# EAGLE design true_bypass_switch (EAGLE 5.10)
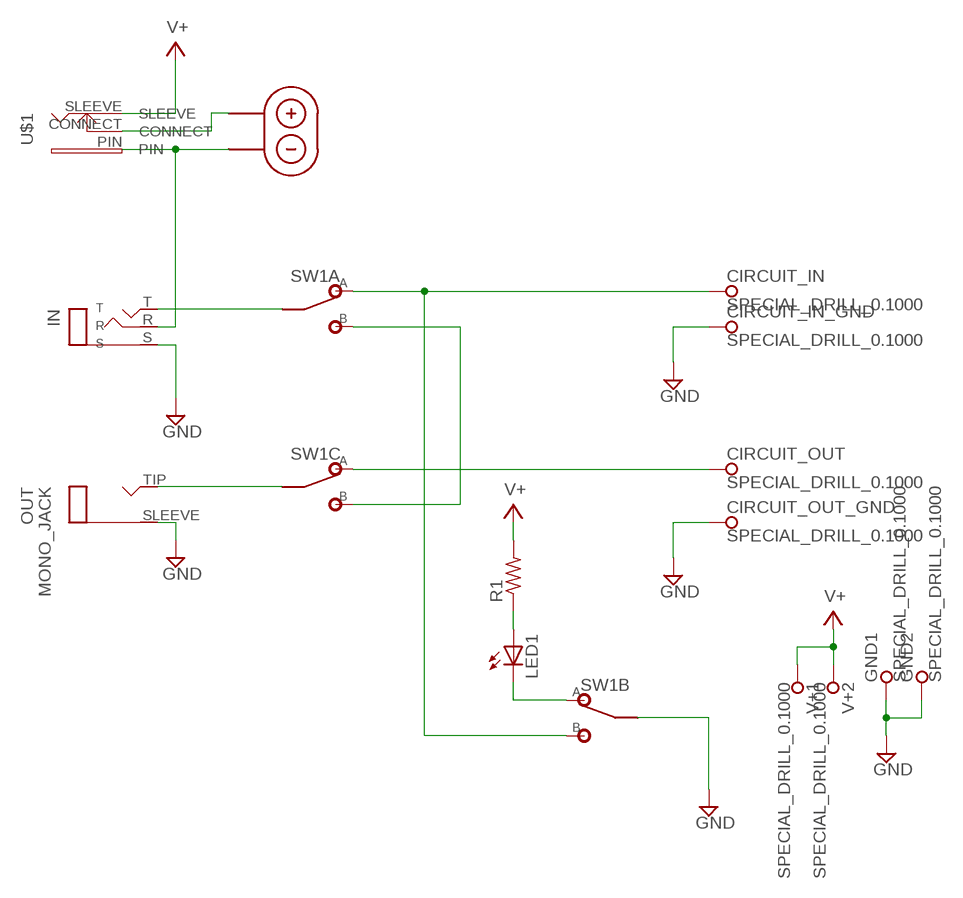
[diagram p0: schematic, sheet 1]

## Parts
CIRCUIT_IN  SPECIAL_DRILL_0.1000  [PAD_0.1000]
CIRCUIT_IN_GND  SPECIAL_DRILL_0.1000  [PAD_0.1000]
CIRCUIT_OUT  SPECIAL_DRILL_0.1000  [PAD_0.1000]
CIRCUIT_OUT_GND  SPECIAL_DRILL_0.1000  [PAD_0.1000]
GND1  SPECIAL_DRILL_0.1000  [PAD_0.1000]
GND2  SPECIAL_DRILL_0.1000  [PAD_0.1000]
IN  STEREO_JACK  [STEREO_JACK]
LED1  LED5MM  [LED5MM]
OUT  MONO_JACK  [MONO_JACK]
R1  RESISTOR  [RESISTOR]
SW1  3PDT  [3PDT]
U$1  DC_JACK_OFFBOARD  [DC_JACK_OFFBOARD]
U$2  9V_BATTERY_CLIP  [9V_BATTERY]
V+1  SPECIAL_DRILL_0.1000  [PAD_0.1000]
V+2  SPECIAL_DRILL_0.1000  [PAD_0.1000]

## Nets
CIRCUIT_IN: CIRCUIT_IN.1 SW1.A1(A:A) SW1.B3(B:B)
CIRCUIT_OUT: CIRCUIT_OUT.1 SW1.C1(C:A)
GND: CIRCUIT_IN_GND.1 CIRCUIT_OUT_GND.1 GND1.1 GND2.1 IN.S OUT.SLEEVE SW1.B2(B:COM)
N$2: U$1.CONNECT U$2.9V_BATTERY_+
N$3: IN.T SW1.A2(A:COM)
N$4: OUT.TIP SW1.C2(C:COM)
N$5: SW1.A3(A:B) SW1.C3(C:B)
N$6: LED1.K(C) SW1.B1(B:A)
N$7: LED1.A R1.1
N$8: IN.R U$1.PIN U$2.9V_BATTERY_-
V+: R1.2 U$1.SLEEVE V+1.1 V+2.1

## Library data of the parts
CIRCUIT_IN CIRCUIT_IN_GND CIRCUIT_OUT CIRCUIT_OUT_GND GND1 GND2 V+1 V+2 = special-drill:SPECIAL_DRILL_: Special drills
IN = 00_steve:STEREO_JACK
LED1 = SparkFun:LED: LEDs Standard schematic elements and footprints for 5mm, 3mm, 1206, and 0603 sized LEDs. 5mm - Spark Fun Electronics SKU : COM-00529 (and others)
OUT = 00_steve:MONO_JACK
R1 = 00_steve:RESISTOR
SW1 = 00_steve:3PDT
U$1 = 00_steve:DC_JACK_OFFBOARD
U$2 = 00_steve:9V_BATTERY_CLIP

## Board
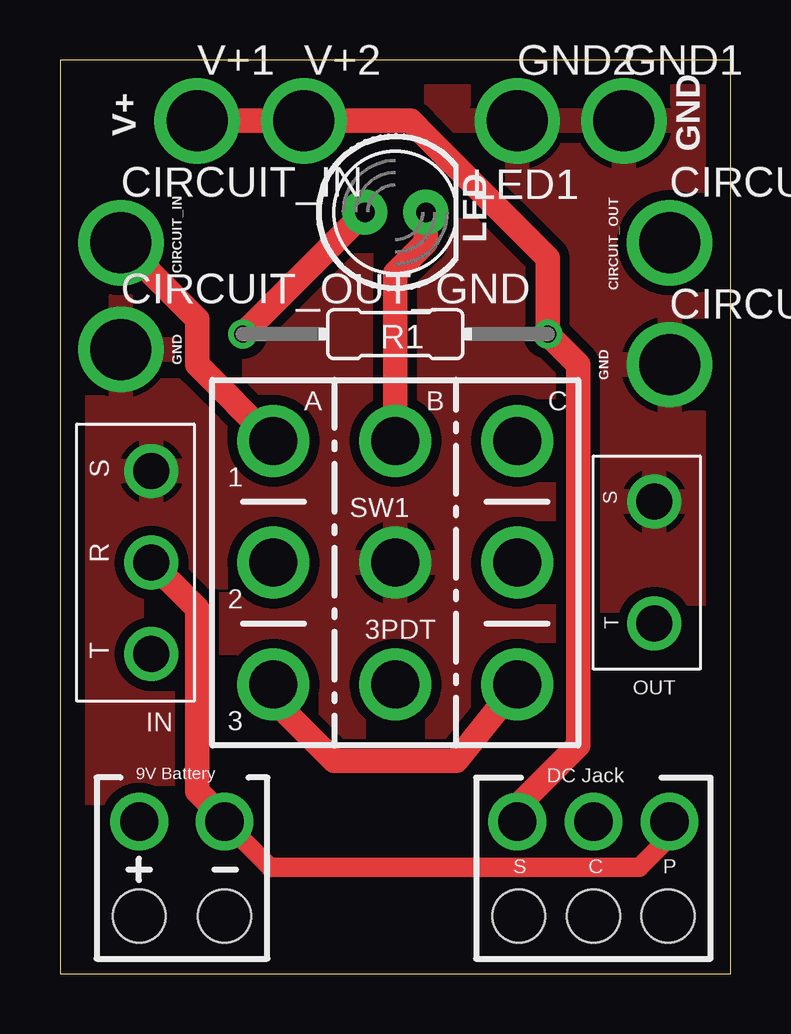
[diagram p1: board, top side]
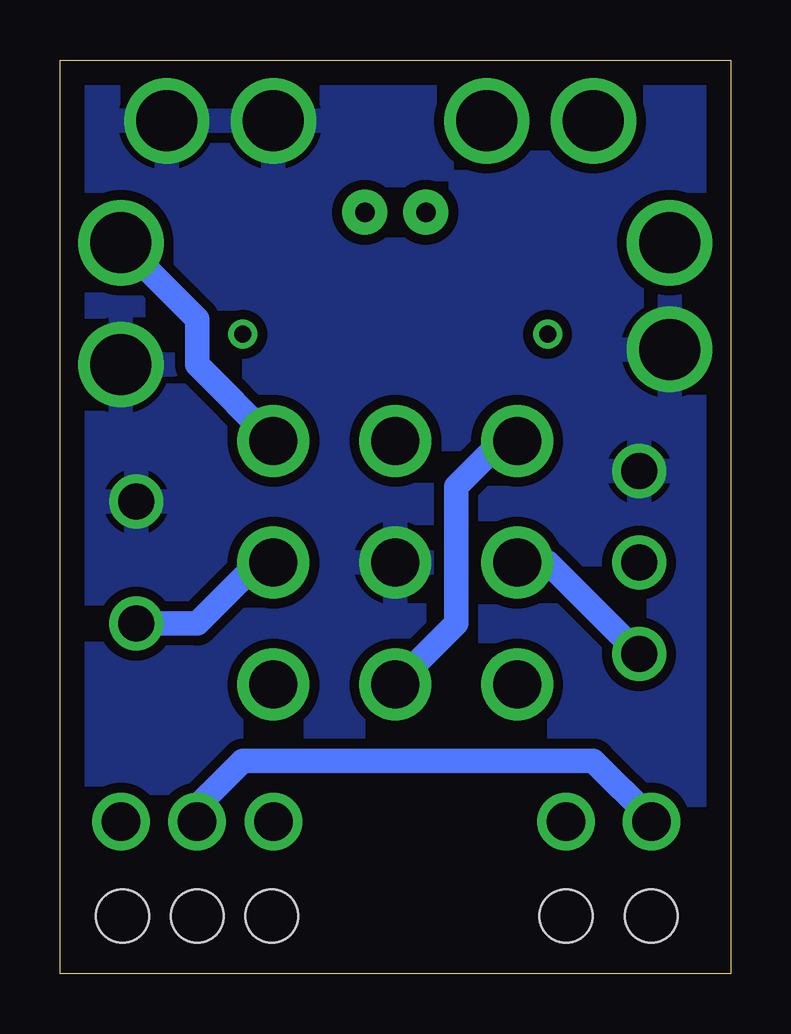
[diagram p2: board, bottom side, seen from below]

Size 27.94 x 38.1 mm. Coordinates in mm from the lower left corner, seen from the top.
Outline: 0,0 27.94,0 27.94,38.1 0,38.1 0,0
Copper layers (1*16): Top 0.035mm / dielectric 1.5mm / Bottom 0.035mm
Design rules "default": minimum track width 10mil, minimum drill 24mil, track to track 8mil, track to pad 8mil, pad to pad 8mil, via to via 8mil, smd to smd 8mil, copper to edge 40mil, drill to drill 8mil, minimum pad ring 10mil, minimum via ring 8mil, stop-mask expansion 4mil, vias tented up to drill 0mil, thermal gap 10mil

### Footprints (pad centres in the part's own frame; a part is rotated, then mirrored left to right if it is on the bottom)
PAD_0.1000 = drill 2.54 pad 2.54 round: 1 0,0
STEREO_JACK = drill 1.5 round: R 0,0; S 3.81,0; T -3.81,0
LED5MM = drill 0.813 pad 1.88 round: A -1.27,0; K 1.27,0
MONO_JACK = drill 1.5 round: SLEEVE 2.54,0; TIP -2.54,0
RESISTOR = drill 0.7 round: 1 -6.35,0; 2 6.35,0
3PDT = drill 2 round: A1 -5.08,5.08; A2 -5.08,0; A3 -5.08,-5.08; B1 0,5.08; B2 0,0; B3 0,-5.08; C1 5.08,5.08; C2 5.08,0; C3 5.08,-5.08
DC_JACK_OFFBOARD = drill 1.6 round: CONNECT 0,1.27; PIN 3.175,1.27; SLEEVE -3.175,1.27 | hole 2.2: -3.111,-2.667; 0,-2.667; 3.111,-2.667
9V_BATTERY = drill 1.6 round: 9V_BATTERY_+ -1.778,1.27; 9V_BATTERY_- 1.778,1.27 | hole 2.2: -1.778,-2.667; 1.778,-2.667

### Placement (x,y rotation side)
CIRCUIT_IN  2.54,30.48 0 top
CIRCUIT_IN_GND  25.4,25.4 0 top
CIRCUIT_OUT  25.4,30.48 0 top
CIRCUIT_OUT_GND  2.54,26.04 0 top
GND1  23.5,35.56 0 top
GND2  19.05,35.56 0 top
IN  3.81,17.14 90 top
LED1  13.97,31.75 0 top
OUT  24.77,17.14 90 top
R1  13.97,26.67 0 top
SW1  13.97,17.14 0 top
U$1  22.23,5.08 0 top
U$2  5.08,5.08 0 top
V+1  5.71,35.56 0 top
V+2  10.16,35.56 0 top

### Tracks (layer width: path | path; a pad name or v marks a point on that pad's centre or on a via)
CIRCUIT_IN
  Top 1.016: CIRCUIT_IN.1 5.71,27.3 5.71,25.4 SW1.A1
  Bottom 1.016: SW1.A1 9.53,22.23 11.43,20.32 11.43,14.61 SW1.B3
CIRCUIT_OUT
  Bottom 1.016: CIRCUIT_OUT.1 22.86,27.94 22.23,27.3 22.23,25.4 SW1.C1
GND
  pour Bottom (isolate 0.406): 0,38.1 27.94,38.1 27.94,0 0,0
  pour Top (isolate 0.406): 0,38.1 27.94,38.1 27.94,0 0,0
N$2
  Bottom 1.016: U$2.9V_BATTERY_+ 3.3,6.48 5.71,8.89 20.32,8.89 22.23,6.99 U$1.CONNECT
N$3
  Bottom 1.016: SW1.A2 7.62,17.14 IN.T
N$4
  Bottom 1.016: SW1.C2 19.68,17.14 22.23,14.61 OUT.TIP
N$5
  Top 1.016: SW1.A3 8.89,11.43 11.43,8.89 16.51,8.89 SW1.C3
N$6
  Top 1.016: SW1.B1 13.97,29.21 15.24,30.48 LED1.K
N$7
  Top 1.016: R1.1 LED1.A
N$8
  Top 0.813: U$1.PIN 25.4,5.71 24.13,4.45 8.76,4.45 U$2.9V_BATTERY_-
  Top 1.016: U$2.9V_BATTERY_- 6.86,6.48 5.71,7.62 5.71,15.24 IN.R
V+
  Top 1.016: U$1.SLEEVE 19.05,6.99 21.59,9.53 21.59,25.4 R1.2 20.32,29.84 15.24,34.92 14.61,35.56 V+2.1 V+1.1

### Text on the board
tPlace: V+ | GND | CIRCUIT_OUT | LED | CIRCUIT_IN | GND | GND